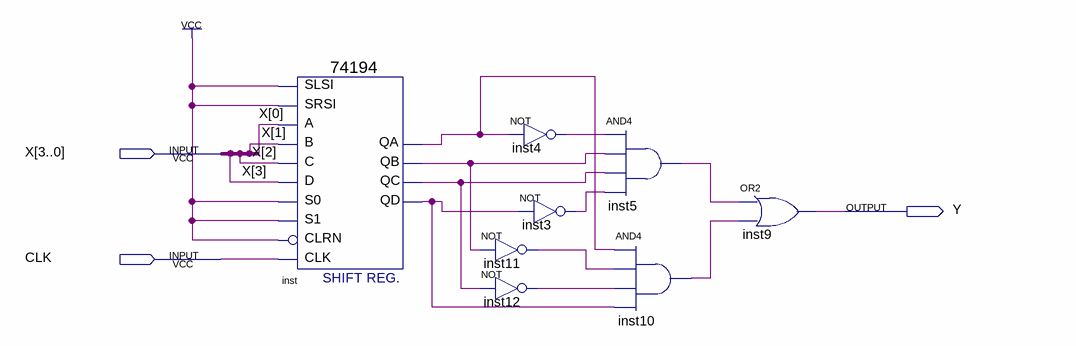
[diagram p0: schematic sheet]
// Quartus schematic MDetSeq.bdf as structural Verilog: 8 symbols, 3 pins
module MDetSeq (
  input  [3:0] X,
  input  CLK,
  output Y
);

  wire inst3_out, inst4_out, inst5_out, inst10_out, inst11_out, inst12_out, inst_qa, inst_qb, inst_qc,
       inst_qd;

  \74194  inst (
    .SLSI(1'b1), .SRSI(1'b1), .B(X[1]), .C(X[2]), .CLK(CLK), .CLRN(1'b1), .D(X[3]), .S1(1'b1), .S0(1'b1),
    .A(X[0]), .QA(inst_qa), .QB(inst_qb), .QC(inst_qc), .QD(inst_qd));
  not inst4 (inst4_out, inst_qa);
  not inst3 (inst3_out, inst_qd);
  not inst11 (inst11_out, inst_qb);
  not inst12 (inst12_out, inst_qc);
  and inst5 (inst5_out, inst4_out, inst_qb, inst_qc, inst3_out);
  and inst10 (inst10_out, inst_qa, inst11_out, inst12_out, inst_qd);
  or inst9 (Y, inst5_out, inst10_out);
endmodule
